# EAGLE design AquaSchematic (EAGLE 9.4.2)
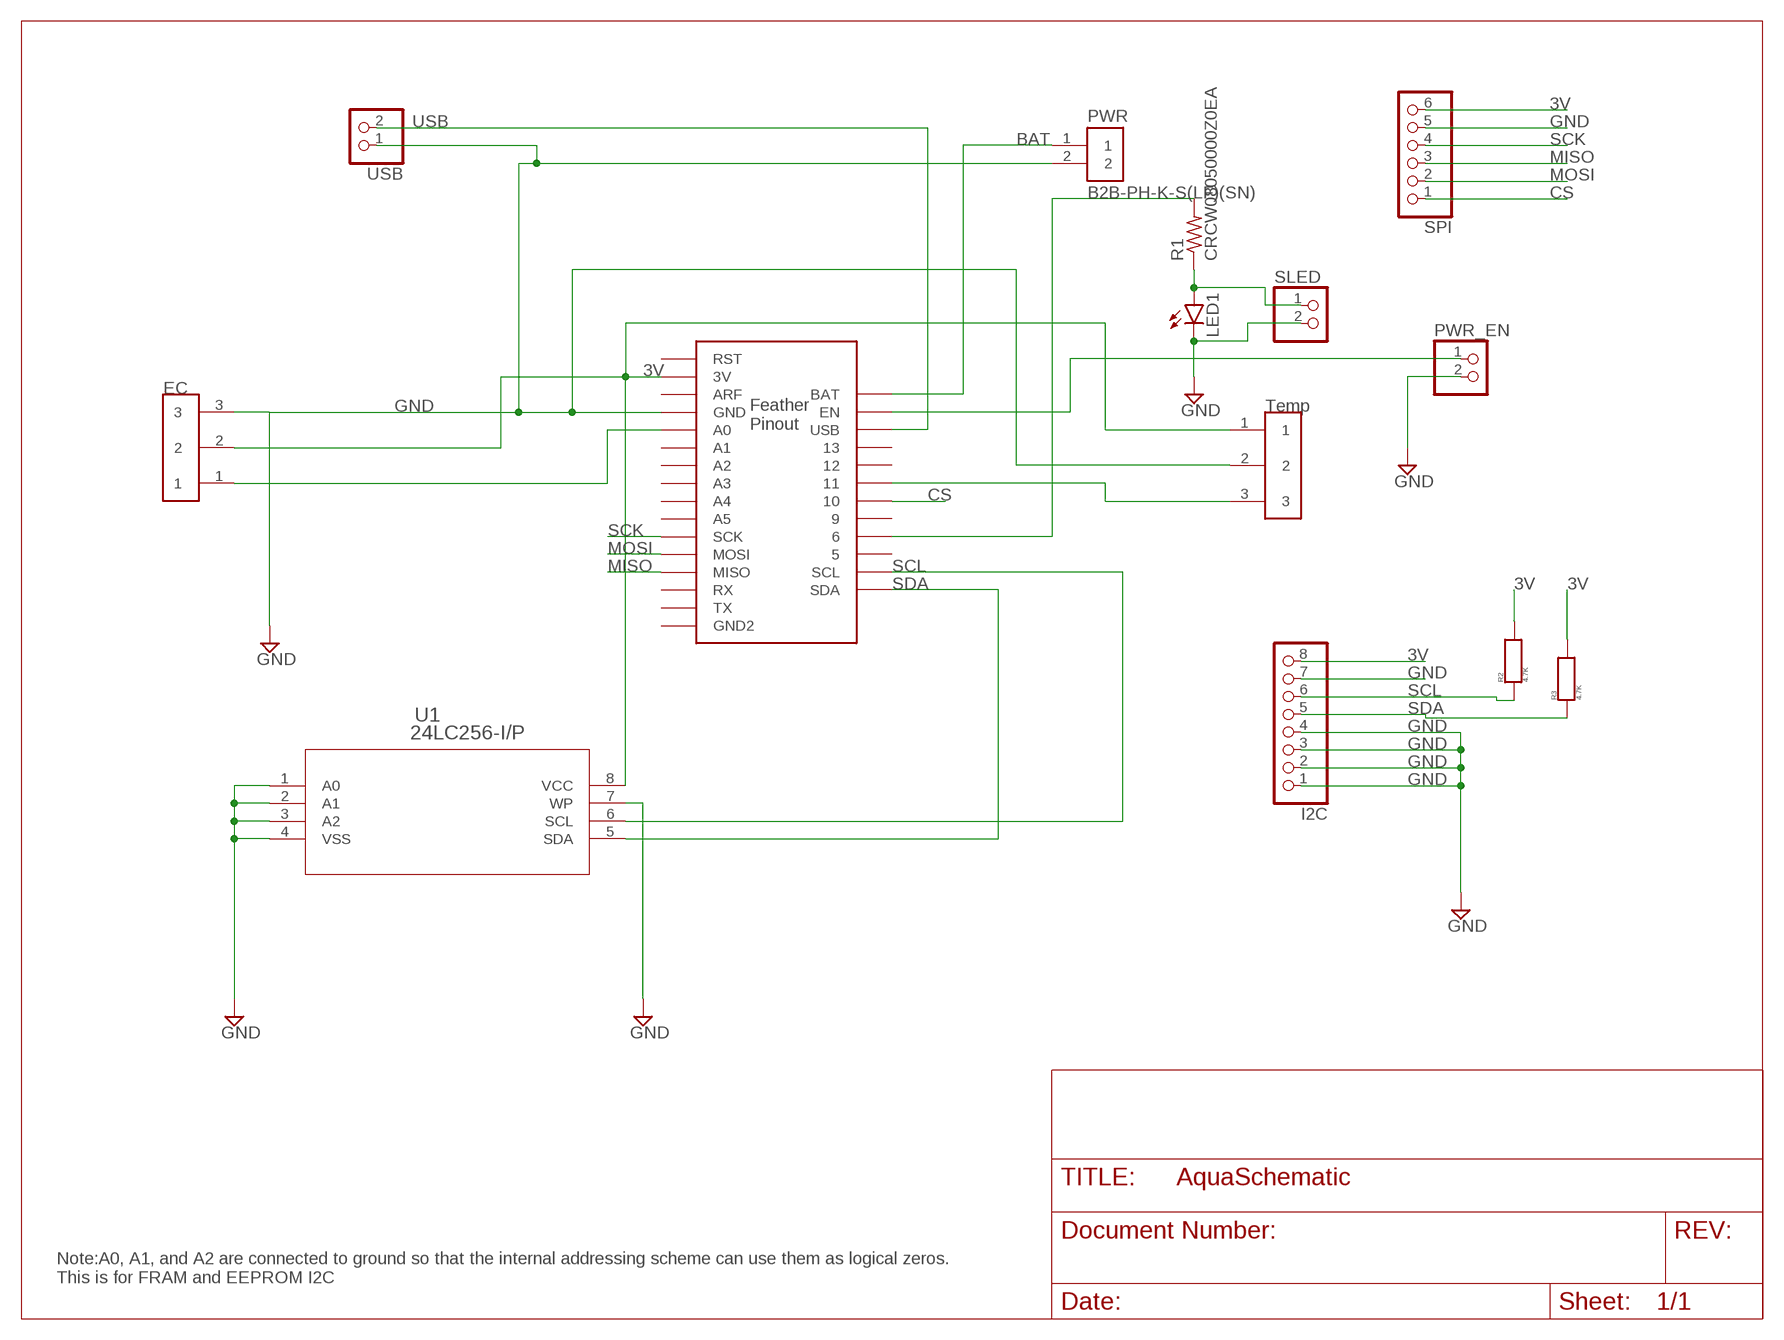
[diagram p0: schematic, sheet 1]

## Parts
EC  39773-0003  [39773-0003]
I2C  PINHD-1X8  [1X08]
LED1  LEDCHIP-LED0805  [CHIP-LED0805]
PWR  B2B-PH-K-S(LF)(SN)  [JST_B2B-PH-K-S(LF)(SN)]
PWR_EN  PINHD-1X2  [1X02]
R1  CRCW08050000Z0EA  [RES_0805]
R2  4.7K  MFR3-4K7FC  [MFR3-4K7FC]
R3  4.7K  MFR3-4K7FC  [MFR3-4K7FC]
SLED  PINHD-1X2  [1X02]
SPI  PINHD-1X6  [1X06]
TEMP  39773-0003  [39773-0003]
U1  24LC256-I/P  [PDIP8_300MC]
U$1  FEATHER_M0_PROTO  [FEATHER_MO_PROTO]
USB  PINHD-1X2  [1X02]

## Nets
3V: EC.2 I2C.8 R2.PIN1 R3.PIN1 SPI.6 TEMP.1 U1.8(VCC) U$1.3V
BAT: PWR.1 U$1.BAT
CS: SPI.1 U$1.10
EN: PWR_EN.1 U$1.EN
GND: EC.3 I2C.1 I2C.2 I2C.3 I2C.4 I2C.7 LED1.C PWR.2 PWR_EN.2 SLED.2 SPI.5 TEMP.2 U1.1(A0) U1.2(A1) U1.3(A2) U1.4(VSS) U1.7(WP) U$1.GND USB.1
MISO: SPI.3 U$1.MISO
MOSI: SPI.2 U$1.MOSI
N$1: LED1.A R1.1 SLED.1
N$2: R1.2 U$1.6
N$3: EC.1 U$1.A0
N$6: TEMP.3 U$1.11
SCK: SPI.4 U$1.SCK
SCL: I2C.6 R2.PIN2 U1.6(SCL) U$1.SCL
SDA: I2C.5 R3.PIN2 U1.5(SDA) U$1.SDA
USB: U$1.USB USB.2
Unconnected: U$1.5 U$1.9 U$1.12 U$1.13 U$1.A1 U$1.A2 U$1.A3 U$1.A4 U$1.A5 U$1.ARF U$1.GND2 U$1.RST U$1.RX U$1.TX

## Notes on the sheet
- EC
- Temp
- Note:A0, A1, and A2 are connected to ground so that the internal addressing scheme can use them as logical zeros. 
  This is for FRAM and EEPROM I2C

## Library data of the parts
EC TEMP = OPEnS Parts:39773-0003: 3 terminal block wiht 2.54mm(0.1in) spacing
I2C = pinhead:PINHD-1X8: PIN HEADER
LED1 = led:LED: LED OSRAM: - CHIPLED LG R971, LG N971, LY N971, LG Q971, LY Q971, LO R971, LY R971 LH N974, LH R974 LS Q976, LO Q976, LY Q976 LO Q996 - Hyper CHIPLED LW Q18S LB Q993, LB Q99A, LB R99A - SideLED LS A670, LO A670, LY A670, LG A670, LP A670 LB A673, LV A673, LT A673, LW A673 LH A674 LY A675 LS A676, LA A676, LO A676, LY A676, LW A676 LS A679, LY A679, LG A679 - Hyper Micro SIDELED® LS Y876, LA Y876, LO Y876, LY Y876 LT Y87S - SmartLED LW L88C, LW L88S LB L89C, LB L89S, LG L890 LS L89K, LO L89K, LY L89K LS L896, LA L896, LO L896, LY L896 - TOPLED LS T670, LO T670, LY T670, LG T670, LP T670 LSG T670, LSP T670, LSY T670, LOP T670, LYG T670 LG T671, LOG T671, LSG T671 LB T673, LV T673, LT T673, LW T673 LH T674 LS T676, LA T676, LO T676, LY T676, LB T676, LH T676, LSB T676, LW T676 LB T67C, LV T67C, LT T67C, LS T67K, LO T67K, LY T67K, LW E67C LS E67B, LA E67B, LO E67B, LY E67B, LB E67C, LV E67C, LT E67C LW T67C LS T679, LY T679, LG T679 LS T770, LO T770, LY T770, LG T770, LP T770 LB T773, LV T773, LT T773, LW T773 LH T774 LS E675, LA E675, LY E675, LS T675 LS T776, LA T776, LO T776, LY T776, LB T776 LHGB T686 LT T68C, LB T68C - Hyper Mini TOPLED® LB M676 - Mini TOPLED Santana® LG M470 LS M47K, LO M47K, LY M47K Source: http://www.osram.convergy.de LUXEON: - LUMILED® LXK2-PW12-R00, LXK2-PW12-S00, LXK2-PW14-U00, LXK2-PW14-V00 LXK2-PM12-R00, LXK2-PM12-S00, LXK2-PM14-U00 LXK2-PE12-Q00, LXK2-PE12-R00, LXK2-PE12-S00, LXK2-PE14-T00, LXK2-PE14-U00 LXK2-PB12-K00, LXK2-PB12-L00, LXK2-PB12-M00, LXK2-PB14-N00, LXK2-PB14-P00, LXK2-PB14-Q00 LXK2-PR12-L00, LXK2-PR12-M00, LXK2-PR14-Q00, LXK2-PR14-R00 LXK2-PD12-Q00, LXK2-PD12-R00, LXK2-PD12-S00 LXK2-PH12-R00, LXK2-PH12-S00 LXK2-PL12-P00, LXK2-PL12-Q00, LXK2-PL12-R00 Source: www.luxeon.com KINGBRIGHT: KA-3528ASYC Source: www.kingbright.com
PWR = B2B-PH-K-S_LF__SN_:B2B-PH-K-S(LF)(SN): PH Series 2 Position 2 mm Pitch Through Hole Top Entry Shrouded Header; DESCRIPTION: PH Series 2 Position 2 mm Pitch Through Hole Top Entry Shrouded Header; DIGI-KEY_PART_NUMBER: 455-1704-ND; DIGI-KEY_PURCHASE_URL: https://www.digikey.ch/product-detail/en/jst-sales-america-inc/B2B-PH-K-S_LF__SN_/455-1704-ND/926611?utm_source=snapeda&utm_medium=aggregator&utm_campaign=symbol; MF: JST Sales; MP: B2B-PH-K-S_LF__SN_; PACKAGE: None
PWR_EN SLED USB = pinhead:PINHD-1X2: PIN HEADER
R1 = Resistor_Capacitor:CRCW08050000Z0EA: RES SMD 0 OHM JUMPER 1/8W 0805 Manufacturer's datasheet <http://www.vishay.com/docs/20035/dcrcwe3.pdf>; CREATED_BY: PCBLayout.com; DIGIKEY_PART_NUMBER: 541-0.0ATR-ND; MANUFACTURER: Vishay Dale; MPN: CRCW08050000Z0EA; PACKAGE: SMD 0805
R2 R3 = OPEnS Parts:MFR3-4K7FC
SPI = pinhead:PINHD-1X6: PIN HEADER
U1 = OPEnS Parts:24LC256-I/P; MANUFACTURER_PART_NUMBER: 24LC256IP; VENDOR: Microchip
U$1 = OPEnS Parts:FEATHER_M0_PROTO

## Board
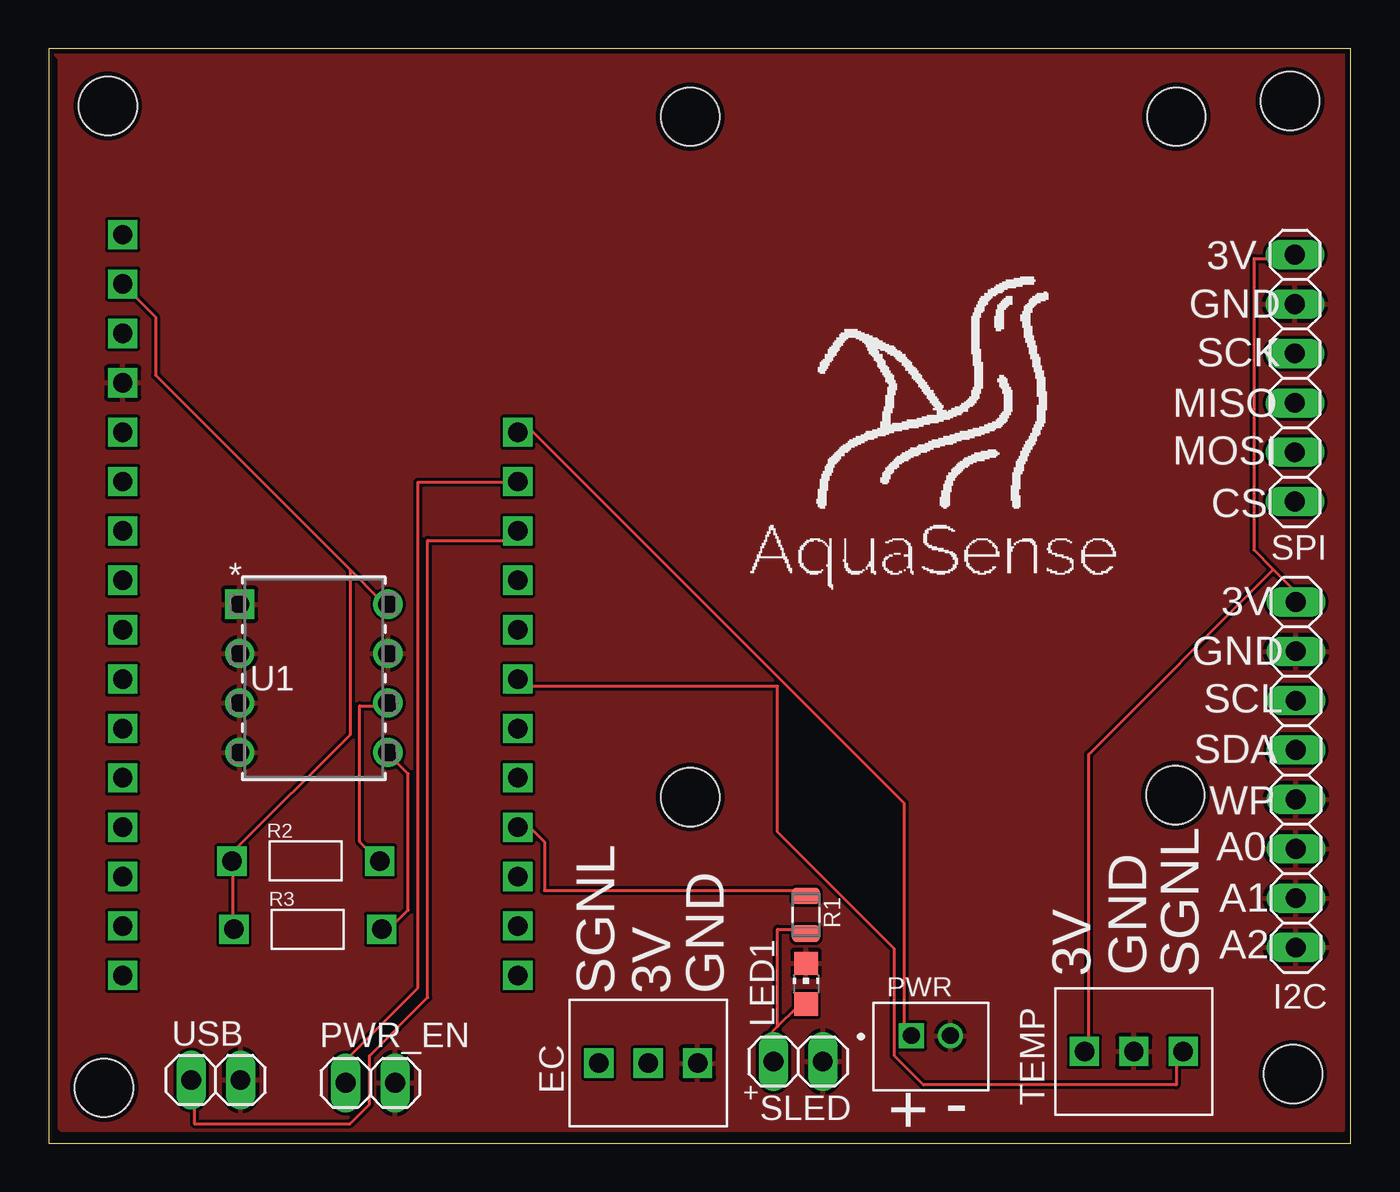
[diagram p1: board, top side]
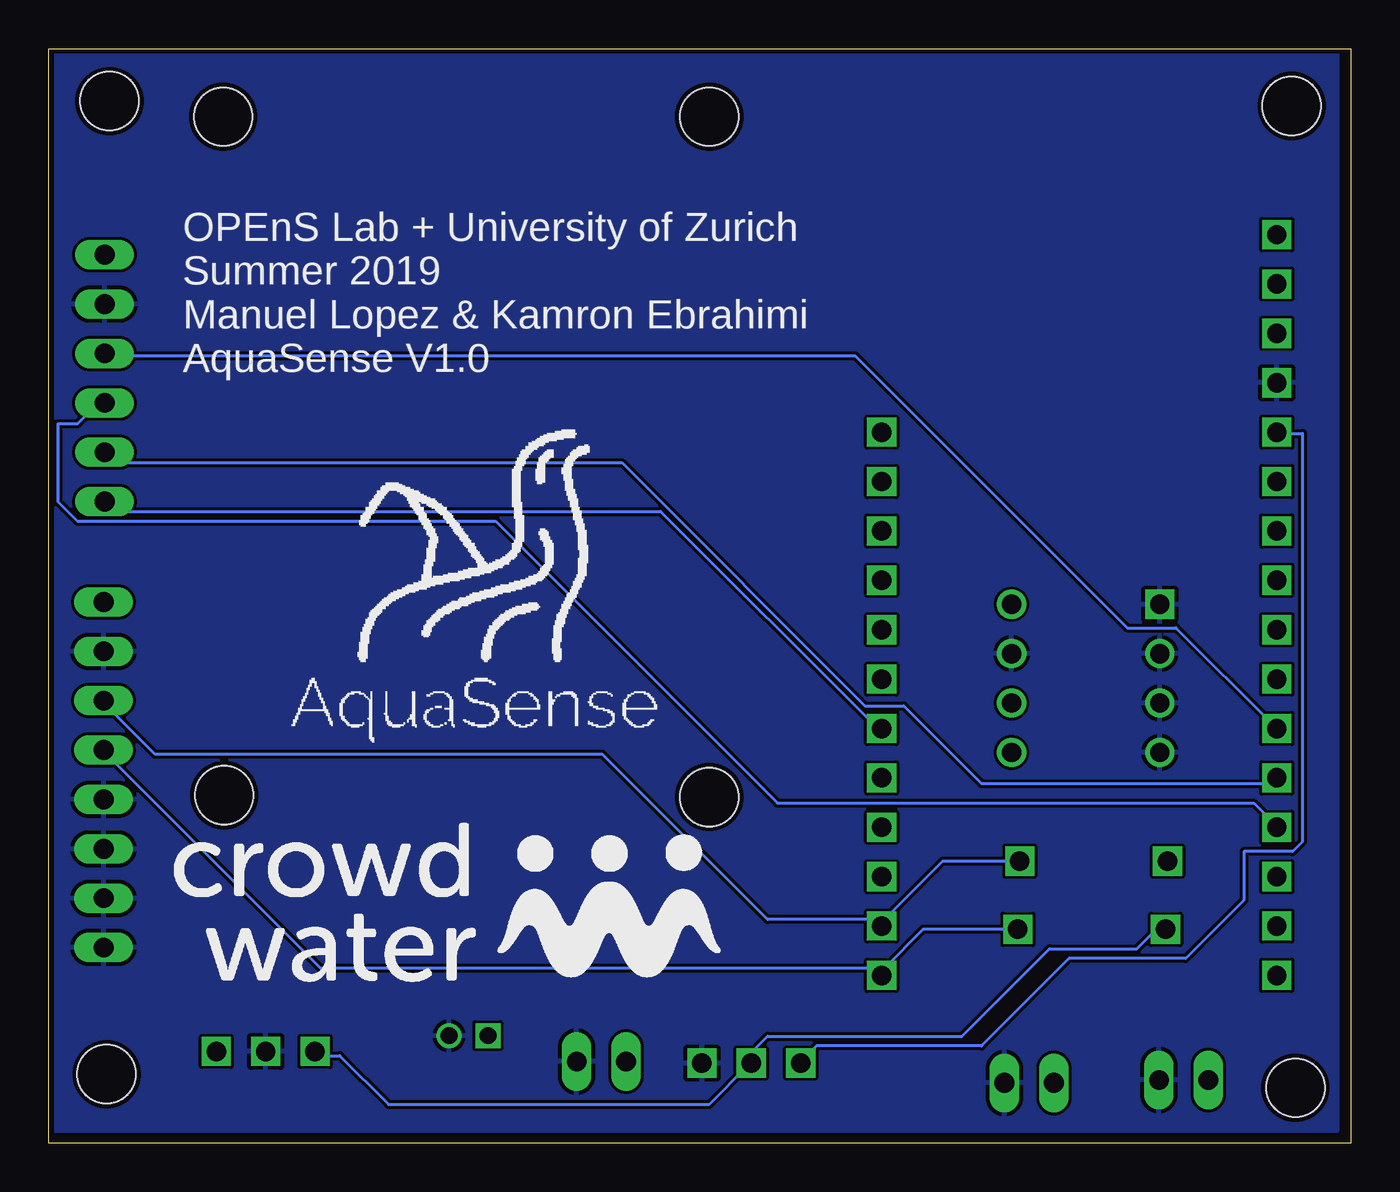
[diagram p2: board, bottom side, seen from below]

Size 66.98 x 56.3 mm. Coordinates in mm from the lower left corner, seen from the top.
Outline: 0,0 66.98,0 66.98,56.3 0,56.3 0,0
Copper layers (1*16): Top 0.018mm / dielectric 1.55mm / Bottom 0.018mm
Design rules "eC_2Layer_PClass6_BaseCopperO18_eCDefault": minimum track width 0.15mm, minimum drill 0.35mm, track to track 0.15mm, track to pad 0.15mm, pad to pad 0.15mm, via to via 0.15mm, smd to smd 0mil, copper to edge 0.25mm, drill to drill 0.35mm, minimum pad ring 0.175mm, minimum via ring 0.125mm, stop-mask expansion 0mil, vias tented up to drill 0.45mm, thermal gap 0.2mm
Holes 3 mm at 3.05,53.35 33,52.8 58,52.8 33,17.8 57.95,17.9 64,3.55 63.85,53.6 2.85,2.85

### Footprints (pad centres in the part's own frame; a part is rotated, then mirrored left to right if it is on the bottom)
39773-0003 = drill 1 square: 1 0,2.54; 2 0,0; 3 0,-2.54
1X08 = drill 1.016 long: 1 -8.89,0; 2 -6.35,0; 3 -3.81,0; 4 -1.27,0; 5 1.27,0; 6 3.81,0; 7 6.35,0; 8 8.89,0
CHIP-LED0805 = smd 1.2 x 1.2: A 0,-1.05; C 0,1.05
JST_B2B-PH-K-S(LF)(SN) = drill 0.86 square: 1 1,-0.55 | drill 0.86: 2 -1,-0.55
1X02 = drill 1.016 long: 1 -1.27,0; 2 1.27,0
RES_0805 = smd 0.87 x 1.42: 1 -0.975,0; 2 0.975,0
MFR3-4K7FC = drill 1 square: PIN1 -3.8,0; PIN2 3.8,0
1X06 = drill 1.016 long: 1 -6.35,0; 2 -3.81,0; 3 -1.27,0; 4 1.27,0; 5 3.81,0; 6 6.35,0
PDIP8_300MC = drill 0.991 pad 1.499 square: 1 -7.62,7.62 | drill 0.991 pad 1.499: 2 -7.62,5.08; 3 -7.62,2.54; 4 -7.62,0; 5 0,0; 6 0,2.54; 7 0,5.08; 8 0,7.62
FEATHER_MO_PROTO = drill 1 square: 3V -10.16,17.78; 5 10.16,-12.7; 6 10.16,-10.16; 9 10.16,-7.62; 10 10.16,-5.08; 11 10.16,-2.54; 12 10.16,0; 13 10.16,2.54; A0 -10.16,10.16; A1 -10.16,7.62; A2 -10.16,5.08; A3 -10.16,2.54; A4 -10.16,0; A5 -10.16,-2.54; ARF -10.16,15.24; BAT 10.16,10.16; EN 10.16,7.62; GND -10.16,12.7; GND2 -10.16,-17.78; MISO -10.16,-10.16; MOSI -10.16,-7.62; RST -10.16,20.32; RX -10.16,-12.7; SCK -10.16,-5.08; SCL 10.16,-15.24; SDA 10.16,-17.78; TX -10.16,-15.24; USB 10.16,5.08

### Placement (x,y rotation side)
EC  30.84,4.12 90 top
I2C  64.15,18.95 90 top
LED1  38.96,8.2 0 top
PWR  45.38,4.98 180 top
PWR_EN  16.55,3.1 0 top
R1  38.96,11.75 90 top
R2  13.23,14.51 0 top
R3  13.33,11 0 top
SLED  38.55,4.2 0 top
SPI  64.1,39.35 90 top
TEMP  55.82,4.72 90 top
U1  17.45,20.1 0 top
U$1  13.97,26.41 0 top
USB  8.6,3.25 180 top

### Tracks (layer width: path | path; a pad name or v marks a point on that pad's centre or on a via)
3V
  Top 0.15: R3.PIN1 9.5,11 9.5,14.5 R2.PIN1 9.5,15 15.5,21 15.5,29.5 | 15.5,29.5 5.5,39.5 5.5,42.5 U$1.3V | 15.5,29.5 17,28 U1.8 | 63,29.5 64,28.5 64,28 I2C.8 | 63,29.5 62,30.5 62,45.5 64,45.5 SPI.6 | 63,29.5 53.5,20 53.5,5 TEMP.1
  Bottom 0.15: TEMP.1 53,4.5 52,4.5 49.5,2 33,2 31,4 EC.2 31,4.5 30,5.5 20,5.5 15.5,10 11,10 10,11 R3.PIN1
BAT
  Top 0.15: PWR.1 44,6 44,17.5 24.5,37 U$1.BAT
CS
  Bottom 0.15: U$1.10 24.5,21.5 35.5,32.5 63.5,32.5 64,33 SPI.1
EN
  Top 0.15: U$1.EN 24,34 19,34 19,8 15.5,4.5 15.5,3.5 PWR_EN.1
GND
  pour Top: 0.25,56.05 66.55,56.05 66.6,56 66.6,0.65 0.65,0.65 0.55,0.75 0.55,55.75
  pour Bottom: 0.55,56.05 66.6,56.05 66.65,56 66.65,0.6 0.7,0.6 0.65,0.65 0.65,55.95
MISO
  Bottom 0.15: U$1.MISO 4,16.5 5,17.5 29.5,17.5 44,32 65.5,32 66.5,33 66.5,37 65.5,37 64.5,38 SPI.3
MOSI
  Bottom 0.15: U$1.MOSI 4,18.5 19,18.5 23,22.5 25,22.5 37.5,35 63.5,35 64,35.5 SPI.2
N$1
  Top 0.15: 37.5,6 37,5.5 37,4.5 SLED.1 | 37.5,6 38.5,7 LED1.A | 37.5,6 37.5,11 38.5,11 R1.1
N$2
  Top 0.15: R1.2 38.5,13 25.5,13 25.5,15.5 24.5,16.5 U$1.6
N$3
  Bottom 0.15: EC.1 28,4.5 27.5,5 19,5 14.5,9.5 8.5,9.5 5.5,12.5 5.5,15 3,15 2.5,15.5 2.5,36.5 3.5,36.5 U$1.A0
N$6
  Top 0.15: U$1.11 24.5,23.5 37.5,23.5 37.5,16 43.5,10 43.5,4.5 45,3 58,3 58,4.5 TEMP.3
SCK
  Bottom 0.15: U$1.SCK 4,21.5 9,26.5 11.5,26.5 25.5,40.5 64,40.5 SPI.4
SCL
  Top 0.15: U1.6 17,22.5 16,22.5 16,15.5 17,14.5 R2.PIN2
  Bottom 0.15: R2.PIN2 17.5,14.5 21,14.5 24,11.5 U$1.SCL 24.5,11.5 30,11.5 38.5,20 61.5,20 64,22.5 I2C.6
SDA
  Top 0.15: U1.5 17.5,20 18.5,19 18.5,12 17.5,11 R3.PIN2
  Bottom 0.15: R3.PIN2 22,11 24,9 U$1.SDA 24.5,9 53,9 64,20 I2C.5
USB
  Top 0.15: U$1.USB 24,31 19.5,31 19.5,7.5 16.5,4.5 16.5,2 15.5,1 7.5,1 7.5,3 USB.2

### Text on the board
tPlace: 3V | GND | SCK | MISO | MOSI | CS | 3V | GND | SCL | SDA | WP | A0 | A1 | 3V | A2 | 3V | GND | SGNL | SGNL | GND | + | + | -
bPlace: OPEnS Lab + University of Zurich / Summer 2019 / Manuel Lopez & Kamron Ebrahimi / AquaSense V1.0